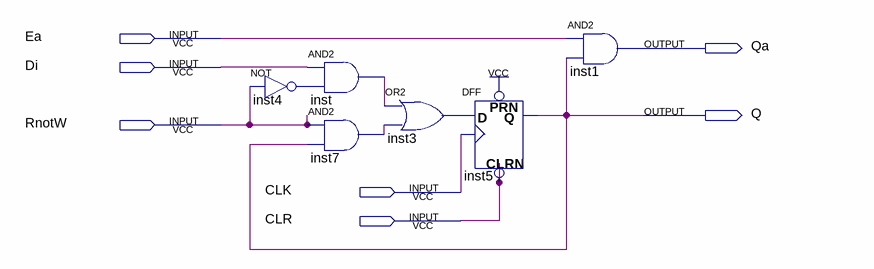
[diagram p0: schematic sheet]
// Quartus schematic oneBitRegister.bdf as structural Verilog: 6 symbols, 7 pins
module oneBitRegister (
  input  Ea,
  input  Di,
  input  RnotW,
  input  CLK,
  input  CLR,
  output Qa,
  output Q
);

  wire inst3_out, inst4_out, inst7_out, inst_out;

  and inst (inst_out, Di, inst4_out);
  not inst4 (inst4_out, RnotW);
  and inst7 (inst7_out, RnotW, Q);
  or inst3 (inst3_out, inst_out, inst7_out);
  DFF inst5 (.CLRN(CLR), .CLK(CLK), .D(inst3_out), .PRN(1'b1), .Q(Q));
  and inst1 (Qa, Ea, Q);
endmodule
